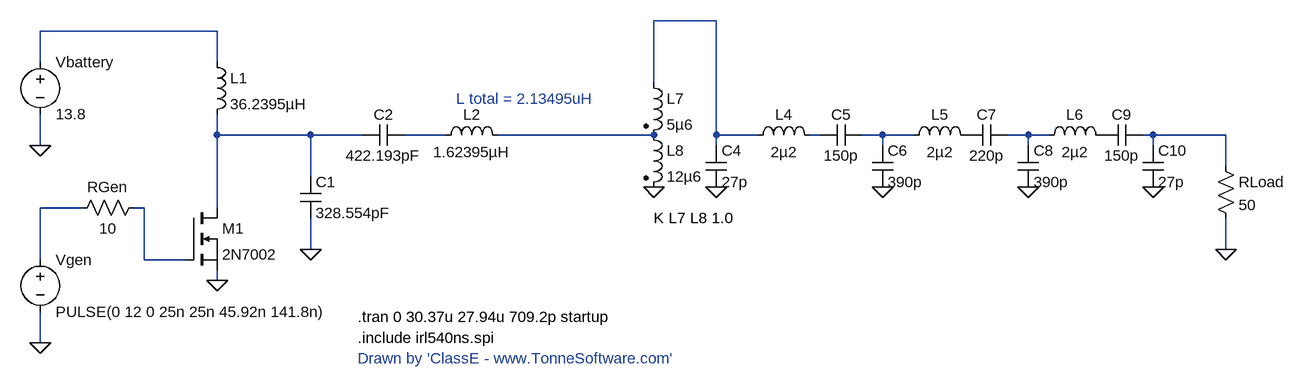
[diagram p0: schematic classe-transformer-bpf.asc]
classe-transformer-bpf.asc, the LTspice schematic file:
Version 4
SHEET 1 2028 388
WIRE 1040 -288 944 -288
WIRE 272 -272 0 -272
WIRE 0 -224 0 -272
WIRE 272 -224 272 -272
WIRE 944 -192 944 -288
WIRE 272 -112 272 -144
WIRE 416 -112 272 -112
WIRE 496 -112 416 -112
WIRE 624 -112 560 -112
WIRE 944 -112 704 -112
WIRE 1040 -112 1040 -288
WIRE 1104 -112 1040 -112
WIRE 1200 -112 1184 -112
WIRE 1296 -112 1264 -112
WIRE 1344 -112 1296 -112
WIRE 1520 -112 1488 -112
WIRE 1552 -112 1520 -112
WIRE 1712 -112 1696 -112
WIRE 1824 -112 1712 -112
WIRE 0 -96 0 -144
WIRE 1040 -96 1040 -112
WIRE 1296 -96 1296 -112
WIRE 1520 -96 1520 -112
WIRE 1712 -96 1712 -112
WIRE 1824 -64 1824 -112
WIRE 416 -48 416 -112
WIRE 64 0 0 0
WIRE 160 0 144 0
WIRE 272 0 272 -112
WIRE 416 64 416 16
WIRE 1824 64 1824 16
WIRE 0 80 0 0
WIRE 160 80 160 0
WIRE 224 80 160 80
WIRE 272 112 272 96
WIRE 0 208 0 160
FLAG 0 208 0
FLAG 272 112 0
FLAG 0 -96 0
FLAG 416 64 0
FLAG 1824 64 0
FLAG 1296 -32 0
FLAG 1520 -32 0
FLAG 1040 -32 0
FLAG 1712 -32 0
FLAG 944 -32 0
SYMBOL voltage 0 -240 R0
WINDOW 123 24 132 Left 2
SYMATTR InstName Vbattery
SYMATTR Value 13.8
SYMBOL voltage 0 64 R0
WINDOW 123 24 132 Left 2
WINDOW 39 0 0 Left 2
SYMATTR InstName Vgen
SYMATTR Value PULSE(0 12 0 25n 25n 45.92n 141.8n)
SYMBOL res 160 -16 R90
WINDOW 0 0 56 VBottom 2
WINDOW 3 32 56 VTop 2
SYMATTR InstName RGen
SYMATTR Value 10
SYMBOL ind 256 -240 R0
SYMATTR InstName L1
SYMATTR Value 36.2395µH
SYMBOL cap 400 -48 R0
SYMATTR InstName C1
SYMATTR Value 328.554pF
SYMBOL cap 560 -128 R90
WINDOW 0 0 32 VBottom 2
WINDOW 3 32 32 VTop 2
SYMATTR InstName C2
SYMATTR Value 422.193pF
SYMBOL ind 608 -96 R270
WINDOW 0 32 56 VTop 2
WINDOW 3 5 56 VBottom 2
SYMATTR InstName L2
SYMATTR Value 1.62395µH
SYMBOL res 1808 -80 R0
SYMATTR InstName RLoad
SYMATTR Value 50
SYMBOL cap 1264 -128 R90
WINDOW 0 0 32 VBottom 2
WINDOW 3 32 32 VTop 2
SYMATTR InstName C5
SYMATTR Value 150p
SYMBOL cap 1280 -96 R0
SYMATTR InstName C6
SYMATTR Value 390p
SYMBOL cap 1488 -128 R90
WINDOW 0 0 32 VBottom 2
WINDOW 3 32 32 VTop 2
SYMATTR InstName C7
SYMATTR Value 220p
SYMBOL cap 1504 -96 R0
SYMATTR InstName C8
SYMATTR Value 390p
SYMBOL cap 1696 -128 R90
WINDOW 0 0 32 VBottom 2
WINDOW 3 32 32 VTop 2
SYMATTR InstName C9
SYMATTR Value 150p
SYMBOL ind 1088 -96 R270
WINDOW 0 32 56 VTop 2
WINDOW 3 5 56 VBottom 2
SYMATTR InstName L4
SYMATTR Value 2µ2
SYMBOL ind 1328 -96 R270
WINDOW 0 32 56 VTop 2
WINDOW 3 5 56 VBottom 2
SYMATTR InstName L5
SYMATTR Value 2µ2
SYMBOL ind 1536 -96 R270
WINDOW 0 32 56 VTop 2
WINDOW 3 5 56 VBottom 2
SYMATTR InstName L6
SYMATTR Value 2µ2
SYMBOL cap 1024 -96 R0
SYMATTR InstName C4
SYMATTR Value 27p
SYMBOL cap 1696 -96 R0
SYMATTR InstName C10
SYMATTR Value 27p
SYMBOL nmos 224 0 R0
SYMATTR InstName M1
SYMATTR Value 2N7002
SYMBOL ind2 928 -208 R0
SYMATTR InstName L7
SYMATTR Value 5µ6
SYMATTR Type ind
SYMBOL ind2 928 -128 R0
SYMATTR InstName L8
SYMATTR Value 12µ6
SYMATTR Type ind
TEXT 488 168 Left 2 !.tran 0 30.37u 27.94u 709.2p startup
TEXT 488 232 Left 2 ;Drawn by 'ClassE - www.TonneSoftware.com'
TEXT 640 -168 Left 2 ;L total = 2.13495uH
TEXT 488 200 Left 2 !.include irl540ns.spi
TEXT 944 16 Left 2 !K L7 L8 1.0

The netlist it stands for:
* classe-transformer-bpf.asc
Vbattery N002 0 13.8
Vgen N010 0 PULSE(0 12 0 25n 25n 45.92n 141.8n)
RGen N011 N010 10
L1 N002 N003 36.2395µH
C1 N003 0 328.554pF
C2 N004 N003 422.193pF
L2 N004 N005 1.62395µH
RLoad N009 0 50
C5 N007 N006 150p
C6 N007 0 390p
C7 N008 P001 220p
C8 N008 0 390p
C9 N009 P002 150p
L4 N001 N006 2µ2
L5 N007 P001 2µ2
L6 N008 P002 2µ2
C4 N001 0 27p
C10 N009 0 27p
M1 N003 N011 0 0 2N7002
L7 N001 N005 5µ6
L8 N005 0 12µ6
.model NMOS NMOS
.model PMOS PMOS
.lib standard.mos
.tran 0 30.37u 27.94u 709.2p startup
* Drawn by 'ClassE - www.TonneSoftware.com'
* L total = 2.13495uH
.include irl540ns.spi
K L7 L8 1.0
.backanno
.end